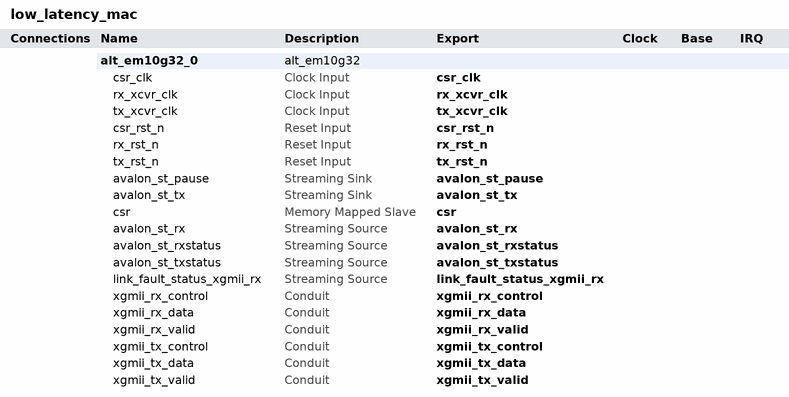
[diagram p0: system contents]
# Platform Designer (Qsys) system low_latency_mac, Arria 10 10AX115R3F40I2SGES
# Parameters at their usual value, and those the tool derives, are not listed.
package require qsys
create_system low_latency_mac
set_project_property DEVICE_FAMILY {Arria 10}
set_project_property DEVICE 10AX115R3F40I2SGES

add_instance alt_em10g32_0 alt_em10g32 14.1
set_instance_property alt_em10g32_0 AUTO_EXPORT true
set_instance_parameter_value alt_em10g32_0 INSERT_ST_ADAPTOR 0
set_instance_parameter_value alt_em10g32_0 INSERT_CSR_ADAPTOR 1
set_instance_parameter_value alt_em10g32_0 INSERT_XGMII_ADAPTOR 0
set_instance_parameter_value alt_em10g32_0 DATAPATH_OPTION 3
set_instance_parameter_value alt_em10g32_0 ENABLE_SUPP_ADDR 1
set_instance_parameter_value alt_em10g32_0 ENABLE_PFC 0
set_instance_parameter_value alt_em10g32_0 PFC_PRIORITY_NUMBER 8
set_instance_parameter_value alt_em10g32_0 INSTANTIATE_STATISTICS 1
set_instance_parameter_value alt_em10g32_0 REGISTER_BASED_STATISTICS 0
set_instance_parameter_value alt_em10g32_0 PREAMBLE_PASSTHROUGH 0
set_instance_parameter_value alt_em10g32_0 ENABLE_TIMESTAMPING 0
set_instance_parameter_value alt_em10g32_0 ENABLE_PTP_1STEP 0
set_instance_parameter_value alt_em10g32_0 TSTAMP_FP_WIDTH 4
set_instance_parameter_value alt_em10g32_0 TIME_OF_DAY_FORMAT 2
set_instance_parameter_value alt_em10g32_0 ENABLE_1G10G_MAC 0
set_instance_parameter_value alt_em10g32_0 ENABLE_MEM_ECC 0
set_instance_parameter_value alt_em10g32_0 ENABLE_UNIDIRECTIONAL 0
set_instance_parameter_value alt_em10g32_0 ENABLE_10GBASER_REG_MODE 1

# exported interfaces
add_interface csr avalon slave
set_interface_property csr EXPORT_OF alt_em10g32_0.csr
add_interface csr_clk clock sink
set_interface_property csr_clk EXPORT_OF alt_em10g32_0.csr_clk
add_interface csr_rst_n reset sink
set_interface_property csr_rst_n EXPORT_OF alt_em10g32_0.csr_rst_n
add_interface tx_rst_n reset sink
set_interface_property tx_rst_n EXPORT_OF alt_em10g32_0.tx_rst_n
add_interface rx_rst_n reset sink
set_interface_property rx_rst_n EXPORT_OF alt_em10g32_0.rx_rst_n
add_interface avalon_st_tx avalon_streaming sink
set_interface_property avalon_st_tx EXPORT_OF alt_em10g32_0.avalon_st_tx
add_interface avalon_st_pause avalon_streaming sink
set_interface_property avalon_st_pause EXPORT_OF alt_em10g32_0.avalon_st_pause
add_interface avalon_st_txstatus avalon_streaming source
set_interface_property avalon_st_txstatus EXPORT_OF alt_em10g32_0.avalon_st_txstatus
add_interface link_fault_status_xgmii_rx avalon_streaming source
set_interface_property link_fault_status_xgmii_rx EXPORT_OF alt_em10g32_0.link_fault_status_xgmii_rx
add_interface avalon_st_rx avalon_streaming source
set_interface_property avalon_st_rx EXPORT_OF alt_em10g32_0.avalon_st_rx
add_interface avalon_st_rxstatus avalon_streaming source
set_interface_property avalon_st_rxstatus EXPORT_OF alt_em10g32_0.avalon_st_rxstatus
add_interface rx_xcvr_clk clock sink
set_interface_property rx_xcvr_clk EXPORT_OF alt_em10g32_0.rx_xcvr_clk
add_interface tx_xcvr_clk clock sink
set_interface_property tx_xcvr_clk EXPORT_OF alt_em10g32_0.tx_xcvr_clk
add_interface xgmii_tx_valid conduit end
set_interface_property xgmii_tx_valid EXPORT_OF alt_em10g32_0.xgmii_tx_valid
add_interface xgmii_rx_valid conduit end
set_interface_property xgmii_rx_valid EXPORT_OF alt_em10g32_0.xgmii_rx_valid
add_interface xgmii_tx_data conduit end
set_interface_property xgmii_tx_data EXPORT_OF alt_em10g32_0.xgmii_tx_data
add_interface xgmii_tx_control conduit end
set_interface_property xgmii_tx_control EXPORT_OF alt_em10g32_0.xgmii_tx_control
add_interface xgmii_rx_data conduit end
set_interface_property xgmii_rx_data EXPORT_OF alt_em10g32_0.xgmii_rx_data
add_interface xgmii_rx_control conduit end
set_interface_property xgmii_rx_control EXPORT_OF alt_em10g32_0.xgmii_rx_control

set_interconnect_requirement {$system} qsys_mm.clockCrossingAdapter HANDSHAKE
set_interconnect_requirement {$system} qsys_mm.maxAdditionalLatency 1
set_interconnect_requirement {$system} qsys_mm.insertDefaultSlave FALSE

save_system low_latency_mac.qsys
